# Altium project Krapong-ROV-B-TUBE.PrjPcb
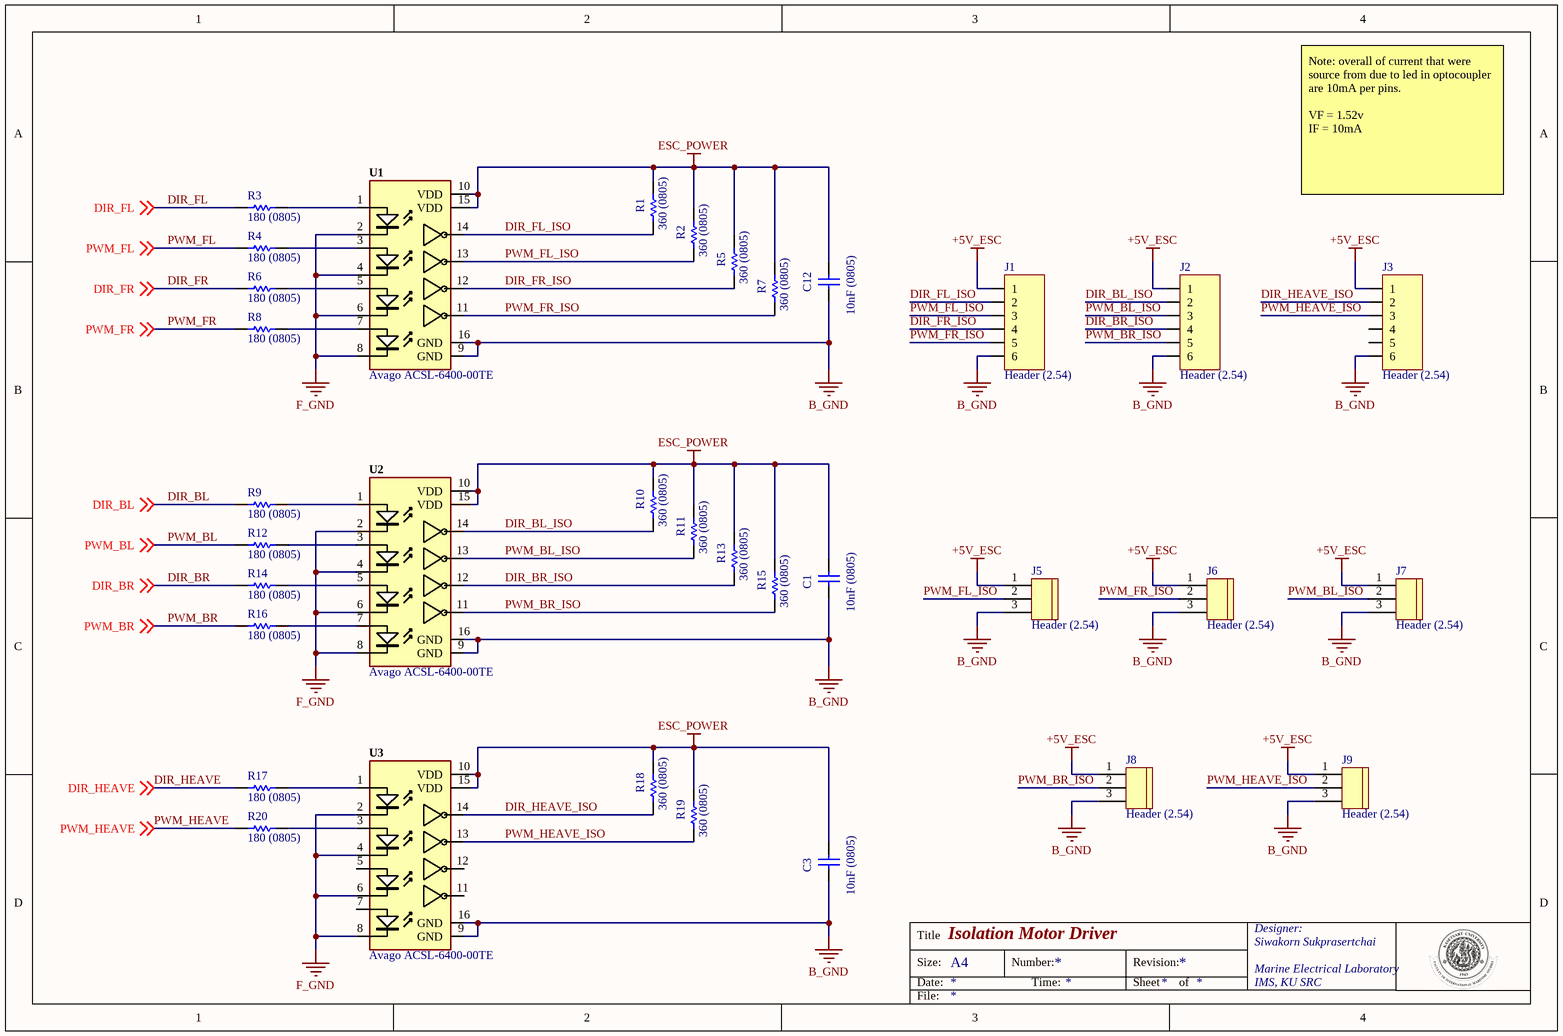
[diagram p0: PWM_Isolated.SchDoc]
3 sheets, 76 parts. Net scope: global (net labels, ports and power ports of the same name join across sheets).
Sheets:
  PWM_Isolated.SchDoc
  Power.SchDoc
  Nano_Shield.SchDoc

## Sheet PWM_Isolated.SchDoc: Isolation Motor Driver
size A4; PageSetup: Record=PageOptions|CenterHorizontal=True|CenterVertical=True|PrintScale=0.97|XCorrection=1.00|YCorrection=1.00|PrintKind=0|BorderSize=5000000|LeftOffset=0|BottomOffset=0|Orientation=2|PaperLength=1000|PaperWidth=1000|Scale=100|PaperSource=7|PrintQuality=-3|MediaType=1|DitherType=10|PrintScaleMode=1|PaperKind=A4|PaperIndex=9

### Parts
C1  10nF (0805)  [CAPC2013X94X50NL20T25]
C3  10nF (0805)  [CAPC2013X94X50NL20T25]
C12  10nF (0805)  [CAPC2013X94X50NL20T25]
J1  Header (2.54)  [PCB-cqg2o6bffgevoirlg0wu-1]
J2  Header (2.54)  [PCB-cqg2o6bffgevoirlg0wu-1]
J3  Header (2.54)  [PCB-cqg2o6bffgevoirlg0wu-1]
J5  Header (2.54)  [PCB-euxx5fdf5mehbg45u1ir-1]
J6  Header (2.54)  [PCB-euxx5fdf5mehbg45u1ir-1]
J7  Header (2.54)  [PCB-euxx5fdf5mehbg45u1ir-1]
J8  Header (2.54)  [PCB-euxx5fdf5mehbg45u1ir-1]
J9  Header (2.54)  [PCB-euxx5fdf5mehbg45u1ir-1]
R1  360 (0805)  [RESC2013X60X40NL15T20]
R2  360 (0805)  [RESC2013X60X40NL15T20]
R3  180 (0805)  [RESC2013X60X40NL15T20]
R4  180 (0805)  [RESC2013X60X40NL15T20]
R5  360 (0805)  [RESC2013X60X40NL15T20]
R6  180 (0805)  [RESC2013X60X40NL15T20]
R7  360 (0805)  [RESC2013X60X40NL15T20]
R8  180 (0805)  [RESC2013X60X40NL15T20]
R9  180 (0805)  [RESC2013X60X40NL15T20]
R10  360 (0805)  [RESC2013X60X40NL15T20]
R11  360 (0805)  [RESC2013X60X40NL15T20]
R12  180 (0805)  [RESC2013X60X40NL15T20]
R13  360 (0805)  [RESC2013X60X40NL15T20]
R14  180 (0805)  [RESC2013X60X40NL15T20]
R15  360 (0805)  [RESC2013X60X40NL15T20]
R16  180 (0805)  [RESC2013X60X40NL15T20]
R17  180 (0805)  [RESC2013X60X40NL15T20]
R18  360 (0805)  [RESC2013X60X40NL15T20]
R19  360 (0805)  [RESC2013X60X40NL15T20]
R20  180 (0805)  [RESC2013X60X40NL15T20]
U1  Avago ACSL-6400-00TE  [PCB-bbpchabnk3r0s5lan1zs-1]
U2  Avago ACSL-6400-00TE  [PCB-bbpchabnk3r0s5lan1zs-1]
U3  Avago ACSL-6400-00TE  [PCB-bbpchabnk3r0s5lan1zs-1]

### Nets
+5V_ESC: J1.1 J2.1 J3.1 J5.1 J6.1 J7.1 J8.1 J9.1
B_GND: C1.1 C3.1 C12.1 J1.6 J2.6 J3.6 J5.3 J6.3 J7.3 J8.3 J9.3 U1.9(GND) U1.16(GND) U2.9(GND) U2.16(GND) U3.9(GND) U3.16(GND)
ESC_POWER: C1.2 C3.2 C12.2 R1.1 R2.1 R5.1 R7.1 R10.1 R11.1 R13.1 R15.1 R18.1 R19.1 U1.10(VDD) U1.15(VDD) U2.10(VDD) U2.15(VDD) U3.10(VDD) U3.15(VDD)
F_GND: U1.2 U1.4 U1.6 U1.8 U2.2 U2.4 U2.6 U2.8 U3.2 U3.4 U3.6 U3.8
DIR_BL: R9.2 ; off-sheet DIR_BL
DIR_BL_ISO: J2.2 R10.2 U2.14
DIR_BR: R14.2 ; off-sheet DIR_BR
DIR_BR_ISO: J2.4 R13.2 U2.12
DIR_FL: R3.2 ; off-sheet DIR_FL
DIR_FL_ISO: J1.2 R1.2 U1.14
DIR_FR: R6.2 ; off-sheet DIR_FR
DIR_FR_ISO: J1.4 R5.2 U1.12
DIR_HEAVE: R17.2 ; off-sheet DIR_HEAVE
DIR_HEAVE_ISO: J3.2 R18.2 U3.14
PWM_BL: R12.2 ; off-sheet PWM_BL
PWM_BL_ISO: J2.3 J7.2 R11.2 U2.13
PWM_BR: R16.2 ; off-sheet PWM_BR
PWM_BR_ISO: J2.5 J8.2 R15.2 U2.11
PWM_FL: R4.2 ; off-sheet PWM_FL
PWM_FL_ISO: J1.3 J5.2 R2.2 U1.13
PWM_FR: R8.2 ; off-sheet PWM_FR
PWM_FR_ISO: J1.5 J6.2 R7.2 U1.11
PWM_HEAVE: R20.2 ; off-sheet PWM_HEAVE
PWM_HEAVE_ISO: J3.3 J9.2 R19.2 U3.13
NetR3_1: R3.1 U1.1
NetR4_1: R4.1 U1.3
NetR6_1: R6.1 U1.5
NetR8_1: R8.1 U1.7
NetR9_1: R9.1 U2.1
NetR12_1: R12.1 U2.3
NetR14_1: R14.1 U2.5
NetR16_1: R16.1 U2.7
NetR17_1: R17.1 U3.1
NetR20_1: R20.1 U3.3

Not connected (* = marked no-connect by the designer): J3 4 5; U3 5 7 11 12

### Notes on the sheet
- Note: overall of current that were source from due to led in optocoupler are 10mA per pins.
  VF = 1.52v
  IF = 10mA
- Title
- Size:
- Date:
- A4
- Number:
- Time:
- Revision:
- Sheet
- of
- Designer:
- Siwakorn Sukprasertchai
- Marine Electrical Laboratory
- IMS, KU SRC
- File:

### Library data of the parts
C1 C3 C12 = CMP-16466678-5: CAP CER 10NF 50V 5% X7R 0805; Manufacturer Part Number: 08055C103JAT2A; Case/Package (SI): 2012; Capacitance: 1e-08 F; Voltage Rating (DC): 50.0 V; Dielectric Material: Ceramic Multilayer; Lead-Free Status: Lead Free; Insulation Resistance: 1e+11 ?; Size-Width: 0.0012446 m; REACH SVHC Compliance: No SVHC; Capacitance Tolerance: ±5%; Case/Package: 0805; Mounting Style: Surface Mount; Size-Thickness: 0.0009398 m; Dielectric Characteristic: X7R; Octopart Url: https://octopart.com/08055c103jat2a-avx+interconnect+%2F+elco-39513106; Size-Height: 0.00094 m; Size-Length: 0.0020066 m; Number of Pins: 2; RoHS: Compliant; OctopartID: 02fac9aacb8edd3d
J1-J3 = CMP-c0620b0c5e311fa5-2: Wire-To-Board Connector, Right Angle, AMPMODU Mod II Series, Through Hole, Header, 6, 2.54 mm; Manufacturer Part Number: 826947-6; Number of Contacts: 6; Pin Pitch: 2.54 mm; Gender: Male; Current Rating: 3.00 A; ELV Compliant: Compliant; Octopart URL: http://octopart.com/826947-6-te+connectivity+%2F+amp-40155957; Orientation: Right Angle; Housing Color: Green; Contact Material: Phosphor Bronze; REACH SVHC Compliance: No SVHC; Mounting Style: PCB; Packaging: Box; Housing Material: Thermoplastic; Lifecycle Status: Active; Flammability Rating: UL 94 V-0; RoHS: Compliant; Contact Plating: Tin; OctopartID: c0620b0c5e311fa5
J5-J9 = CMP-b27b7b724c836dbc-1: Pin strip (standard) MTA-100 Total number of pins 3 TE Connectivity 640455-3 1 pc(s); Pin Pitch: 2.54 mm; Shrouded: No; Number of Positions: 3; Mounting Angle: 90.0 °; Voltage Rating (AC): 250 V; ELV Compliant: Compliant; Gender: Male; Lead-Free Status: Lead Free; Octopart URL: http://octopart.com/640455-3-te+connectivity+%2F+amp-252830; Manufacturer Part Number: 640455-3; Orientation: Right Angle; Color: Natural; RoHS: Compliant; Packaging: Bulk; Size-Length: 7.62 mm; Lifecycle Status: Active; Number of Contacts: 3; Housing Color: Natural; Contact Material: Copper Alloy; Contact Plating: Tin; Flammability Rating: UL 94 V-0; Mounting Style: Through Hole; Number of Rows: 1; Size-Height: 5.71 mm; Size-Width: 7.87 mm; Housing Material: Polyester; OctopartID: b27b7b724c836dbc
R1-R20 = CMP-1860549-2: RES SMD 10K OHM 1% 1/3W 0805; Lead-Free Status: Lead Free; Power Rating: 0.125 W; Resistance: 10000.0 ?; Voltage Rating (DC): 150.0 V; Case/Package: 0805; Mounting Style: Surface Mount; Number of Pins: 2; Octopart Url: https://octopart.com/crcw080510k0fkeahp-vishay-42634554; OctopartID: fa6931e9523525ae; Packaging: Cut Tape (CT); REACH SVHC Compliance: No SVHC; Resistance Tolerance: ±1%; RoHS: Compliant
U1-U3 = CMP-6f44a640fcefb083-4: Multi-Channel and Bi-Directional, 15 MBd (typ) Digital Logic Gate Optocoupler; Input Current: 0.015 A; Lead-Free Status: Lead Free; Output Voltage: 7.0 V; Number of Channels: 4; Rise Time: 3.5e-08 s; Data Rate: 15000000.0 bps; Isolation Voltage: 2500.0 V; Input Voltage (DC): 1.52 V; Lifecycle Status: Active; Octopart URL: http://octopart.com/acsl-6400-00te-avago-964301; Number of Pins: 16; Packaging: Tube; RoHS: Compliant; REACH SVHC Compliance: No SVHC; Manufacturer Part Number: ACSL-6400-00TE; Mounting Style: Surface Mount; OctopartID: 6f44a640fcefb083; Case/Package: SOIC

## Sheet Power.SchDoc: Power & Interfacing
size A4; PageSetup: Record=PageOptions|CenterHorizontal=True|CenterVertical=True|PrintScale=0.97|XCorrection=1.00|YCorrection=1.00|PrintKind=0|BorderSize=5000000|LeftOffset=0|BottomOffset=0|Orientation=2|PaperLength=1000|PaperWidth=1000|Scale=100|PaperSource=7|PrintQuality=-3|MediaType=1|DitherType=10|PrintScaleMode=1|PaperKind=A4|PaperIndex=9
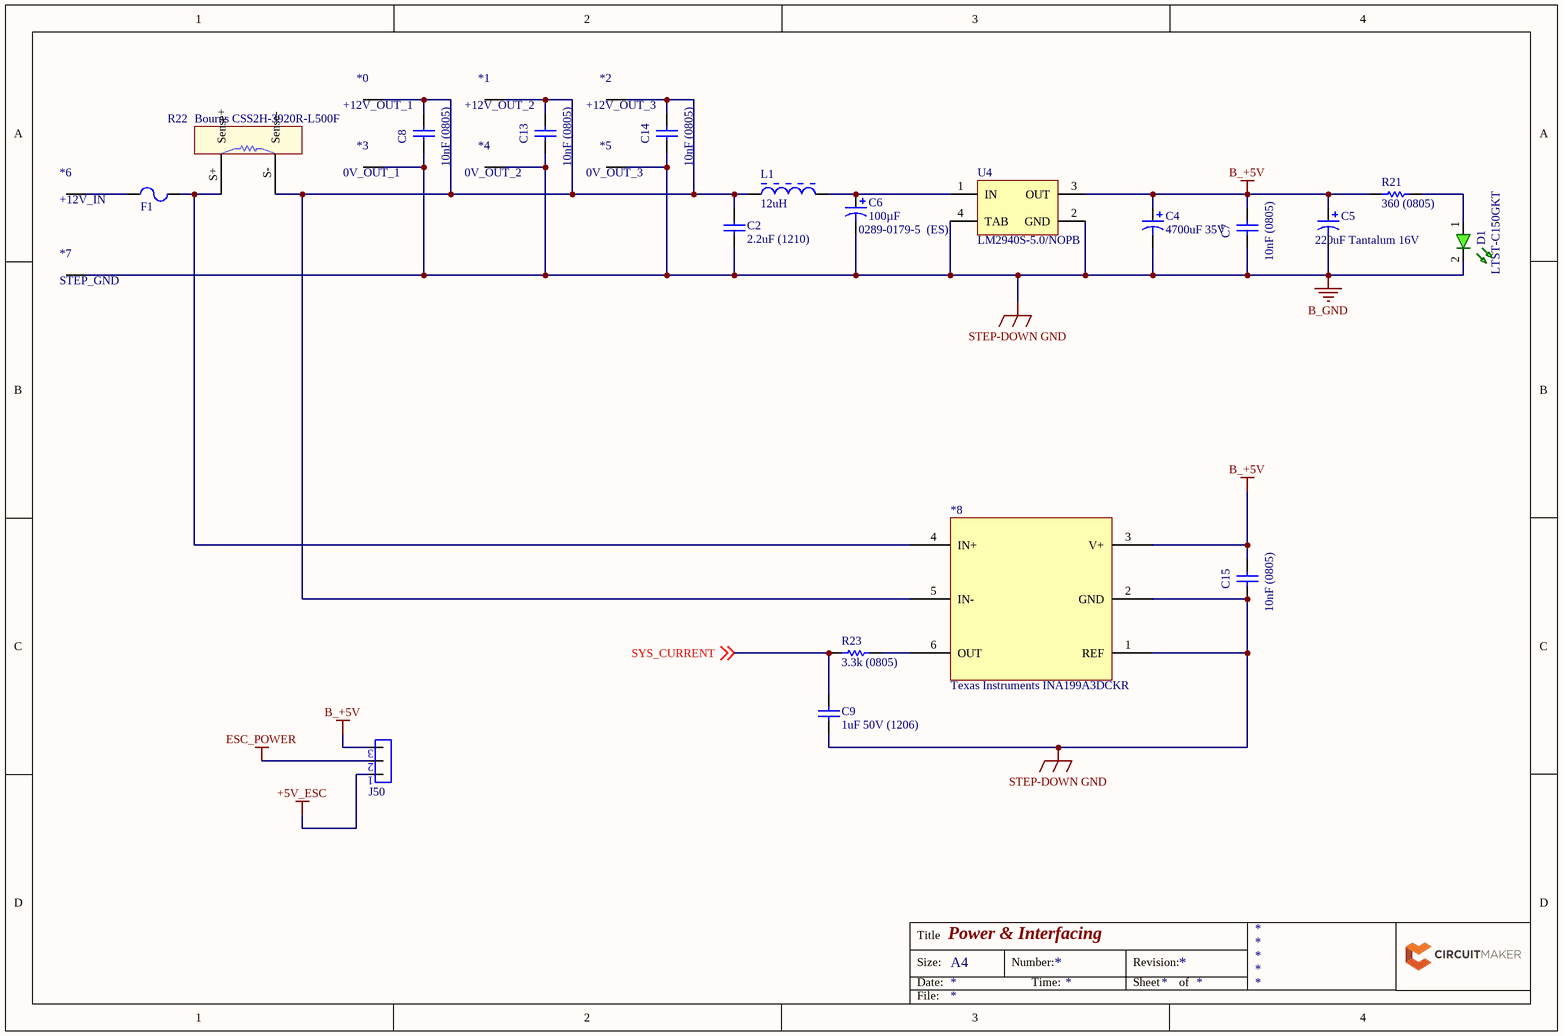
[diagram p1: Power.SchDoc]

### Parts
*0  +12V_OUT_1  [PCB-pcj1l6roq5gpi9u538ps-1]
*1  +12V_OUT_2  [PCB-pcj1l6roq5gpi9u538ps-1]
*2  +12V_OUT_3  [PCB-pcj1l6roq5gpi9u538ps-1]
*3  0V_OUT_1  [PCB-pcj1l6roq5gpi9u538ps-1]
*4  0V_OUT_2  [PCB-pcj1l6roq5gpi9u538ps-1]
*5  0V_OUT_3  [PCB-pcj1l6roq5gpi9u538ps-1]
*6  +12V_IN  [PCB-pcj1l6roq5gpi9u538ps-1]
*7  STEP_GND  [PCB-pcj1l6roq5gpi9u538ps-1]
*8  Texas Instruments INA199A3DCKR  [PCB-77zgin3zajz1p7ole171-1]
C2  2.2uF (1210)  [PCB-2fbb0vau3p468w0y920g-1]
C4  4700uF 35V  [PCB-uagykt4yf5hbq2so0sas-1]
C5  220uF Tantalum 16V  [PCB-fa1e6qpy6fbu77u2ye0h-1]
C6  100µF  OctopartID: 0289-0179-5  (ES)  [PCB-ec5i0bi6g8n3i6bd77c9-1]
C7  10nF (0805)  [CAPC2013X94X50NL20T25]
C8  10nF (0805)  [CAPC2013X94X50NL20T25]
C9  1uF 50V (1206)  [CAPC3216X180X55NL20T25]
C13  10nF (0805)  [CAPC2013X94X50NL20T25]
C14  10nF (0805)  [CAPC2013X94X50NL20T25]
C15  10nF (0805)  [CAPC2013X94X50NL20T25]
D1  Manufacturer Part Number: LTST-C150GKT  [PCB-ol758qabjjwuqvqjb2k1-1]  (hidden comment: Lite-On LTST-C150GKT)
F1  Keystone 3544-2  [PCB-p3yqezitk9kmwwp2mp00-1]  (value not drawn)
J50  TE Connectivity / AMP 5-146274-3  [PCB-m19gj7kkh000buv4lmik-1]  (value not drawn)
L1  12uH  [BOUR-SDR0403-2_V]
R21  360 (0805)  [RESC2013X60X40NL15T20]
R22  Bourns CSS2H-3920R-L500F  [PCB-p7sd064g1v6dorbgawsb-1]
R23  3.3k (0805)  [RESC2013X60X40NL15T20]
U4  LM2940S-5.0/NOPB  [TS3B_L]

### Nets
+5V_ESC: J50.1
B_+5V: *8.3(V+) C4.1 C5.1 C7.2 C15.2 J50.3 R21.1 U4.3(OUT)
B_GND: *3.0 *4.0 *5.0 *7.0 *8.1(REF) *8.2(GND) C2.1 C4.2 C5.2 C6.2 C7.1 C8.1 C9.1 C13.1 C14.1 C15.1 D1.2(K) U4.2(GND) U4.4(TAB)  [also labelled STEP-DOWN GND]
ESC_POWER: J50.2
SYS_CURRENT: C9.2 R23.2 ; off-sheet SYS_CURRENT
Net*0_0: *0.0 *1.0 *2.0 *8.5(IN-) C2.2 C8.2 C13.2 C14.2 L1.1 R22.S-(Sense-)
Net*6_0: *6.0 F1.1
Net*8_4: *8.4(IN+) F1.2 R22.S+(Sense+)
Net*8_6: *8.6(OUT) R23.1
NetC6_1: C6.1 L1.2 U4.1(IN)
NetD1_1: D1.1(A) R21.2

### Notes on the sheet
- Title
- Size:
- Date:
- A4
- Number:
- Time:
- Revision:
- Sheet
- of
- File:

### Library data of the parts
*0-*7 = CMP-5ddc94dc62be821b-2: Standoff; 12 mm; M3 x 0.5; Brass; Hex; Nickel Plate; 8 in.; 8 in.; Manufacturer Part Number: 24314; Lead-Free Status: Lead Free; Size-Width: 5.00 mm; Octopart URL: http://octopart.com/24314-keystone-662020; OctopartID: 5ddc94dc62be821b; Size-Length: 12.0 mm; Material: Brass; RoHS: Compliant
*8 = CMP-6ab6a2a7a250b571-1: 26-V, Bi-Directional, Zero-Drift, Low- or High-Side, Voltage Output Current Shunt Monitor 6-SC70 -40 to 125; Lead-Free Status: Lead Free; Octopart URL: http://octopart.com/ina199a3dckr-texas+instruments-18607488; Manufacturer Part Number: INA199A3DCKR; Lifecycle Status: Active; RoHS: Compliant; OctopartID: 6ab6a2a7a250b571
C2 = Murata GRM32ER71H475KA88L-1: 1210 4.7 uF 50 V ±10% Tolerance X7R SMT Multilayer Ceramic Capacitor; Voltage Rating (DC): 50.0 V; Lead-Free Status: Lead Free; Capacitance: 4.7e-06 F; Case/Package (SI): 3225; Octopart URL: http://octopart.com/grm32er71h475ka88l-murata-196576; Manufacturer Part Number: GRM32ER71H475KA88L; Size-Height: 0.0025 m; Dielectric Characteristic: X7R; Size-Width: 0.0025 m; RoHS: Compliant; REACH SVHC Compliance: No SVHC; Mounting Style: Surface Mount; Capacitance Tolerance: ±10%; Packaging: Cut Tape (CT), Tape & Reel (TR); Size-Length: 0.0032 m; Size-Thickness: 0.0025 m; Lifecycle Status: Active; Case/Package: 1210; Number of Pins: 2; OctopartID: 8d884480570e524f
C4 = CMP-4cda85d37137931d-1: 18mm x 40mm l/s=7.5mm 105deg 4700uf 35v Radial Leads Lesr Aluminum Electrolytic Cap; Manufacturer Part Number: UPW1V472MHD; Voltage Rating (DC): 35.0 V; Lead-Free Status: Lead Free; Capacitance: 0.0047 F; Equivalent Series Resistance (ESR): 0.028 ?; Capacitance Tolerance: ±20%; Octopart URL: http://octopart.com/upw1v472mhd-nichicon-202891; Size-Length: 0.04 m; Size-Height: 0.04 m; RoHS: Compliant; Mounting Style: Through Hole; Dielectric Material: Aluminum Electrolytic; Packaging: Bulk; Size-Diameter: 0.018 m; OctopartID: 4cda85d37137931d
C5 = CMP-d5771c7fde4f0ab0-1: Kemet T491E227K016AT Cap Tant Solid 220uF 16V E CASE 10% (7.3 X 6 X 3.6mm) SMD 7260-38 0.9 Ohm 125C Automotive T/R; Voltage Rating (DC): 16.0 V; Lead-Free Status: Lead Free; Equivalent Series Resistance (ESR): 900 m?; Capacitance: 220 µF; Octopart URL: http://octopart.com/t491e227k016at-kemet-142942; Manufacturer Part Number: T491E227K016AT; Case/Package: 7260-38; Size-Width: 6.00 mm; RoHS: Compliant; Mounting Style: Surface Mount; Dielectric Material: Tantalum; Packaging: Cut Tape (CT), Tape & Reel (TR); Size-Length: 7.30 mm; Size-Height: 3.60 mm; Capacitance Tolerance: ±10%; Number of Pins: 2; OctopartID: d5771c7fde4f0ab0
C6 = CMP-42da8bd37ecc9d1d-1: WX Series 100 uF 25 V ±20 % Surface Mount Chip Aluminum Electrolytic Capacitor; Capacitance Tolerance: ±20%; Voltage Rating (DC): 25.0 V; Size-Height: 5.40 mm; Dielectric Material: Aluminum Electrolytic; Size-Diameter: 8.00 mm
C7 C8 C13-C15 = CMP-16466678-5: as C1 on sheet PWM_Isolated; Size-Width: 0.0012446 m; REACH SVHC Compliance: No SVHC; Capacitance Tolerance: ±5%; Case/Package: 0805; Mounting Style: Surface Mount; Size-Thickness: 0.0009398 m; Dielectric Characteristic: X7R; Octopart Url: https://octopart.com/08055c103jat2a-avx+interconnect+%2F+elco-39513106; Size-Height: 0.00094 m; Size-Length: 0.0020066 m; Number of Pins: 2; RoHS: Compliant; OctopartID: 02fac9aacb8edd3d
C9 = CMP-121173-2: CAP CER 1UF 50V 10% X7R 1206; Capacitance: 1e-06 F; Case/Package (SI): 3216; Lead-Free Status: Lead Free; Voltage Rating (DC): 50.0 V; Capacitance Tolerance: ±10%; Dielectric Characteristic: X7R; Lifecycle Status: Active; Mounting Style: Surface Mount; Octopart Url: https://octopart.com/grm31cr71h105ka61l-murata-197460; OctopartID: 26d9efd000ebf91e; REACH SVHC Compliance: No SVHC; RoHS: Compliant; Size-Length: 0.0032 m; Size-Thickness: 0.0016 m; Size-Width: 0.0016 m
D1 = CMP-d7361e3491ff08f1-2: Green 3.2 x 1.6 x 1.1 mm 130° Water Clear 6 mcd 2.1 V Chip LED Surface Mount; Lead-Free Status: Lead Free; Case/Package (SI): 3216; Luminous Intensity: 6.00 mcd; Forward Voltage: 2.10 V; Lens Type: Non-Diffused; Wavelength: 565 nm; Manufacturer: LITE-ON; Color: Green; RoHS: Compliant; Size-Length: 3.20 mm; Case/Package: 1206; OctopartID: d7361e3491ff08f1; Octopart URL: http://octopart.com/ltst-c150gkt-lite-on-549807; Size-Height: 1.10 mm; Packaging: Tape & Reel (TR); Viewing Angle: 130 °; Mounting Style: Surface Mount, Vertical; Size-Width: 1.60 mm
F1 = CMP-54019d0b3e378bc6-3: Fuse Clip; 500 VAC; 30 A; PCB; For 0.110 in. x 0.032 in. mini blade fuses; Voltage Rating (DC): 500 V; Color: Black; Lead-Free Status: Lead Free; Current Rating: 30.0 A; Number of Circuits: 1; Octopart URL: http://octopart.com/3544-2-keystone-20304; Contact Plating: Brass; Voltage Rating (AC): 500 V; Size-Height: 8.70 mm; Size-Width: 4.76 mm; Packaging: Bulk; RoHS: Compliant; Mounting Style: PCB, Snap-In; Flammability Rating: UL 94 V-0; OctopartID: 54019d0b3e378bc6; REACH SVHC Compliance: No SVHC; Contact Material: Brass; Manufacturer Part Number: 3544-2; Lifecycle Status: Not Listed by Manufacturer; Size-Length: 14.7 mm
J50 = CMP-740dbf71fd8babca-9: AMPMODU 3 Position 2.54 mm Single Row Through-Hole Straight Breakaway Header; ELV Compliant: Compliant; Number of Contacts: 3; Gender: Male; Lead-Free Status: Lead Free; Manufacturer Part Number: 5-146274-3; Octopart URL: http://octopart.com/5-146274-3-te+connectivity+%2F+amp-41331936; Mounting Style: PCB; Contact Material: Phosphor Bronze; Lifecycle Status: Active; Housing Color: Black; OctopartID: 740dbf71fd8babca; RoHS: Compliant; Orientation: Vertical; Flammability Rating: UL 94 V-0; Contact Plating: Tin, Tin over Nickel
L1 = CMP-911394-2: SDR0403 Series Power Inductor, 12 uF +/- 20 %, 0.21 Ohm, -40 to 125 degC, 2-Pin SMD, RoHS, Tape and Reel; Inductance: 1.2e-05 H; Q-Factor: 28.0; Octopart Url: https://octopart.com/sdr0403-120ml-bourns-1990149; OctopartID: 7b20b2340043a4e7; Packaging: Cut Tape (CT); REACH SVHC Compliance: No SVHC; RoHS: Compliant
R21 R23 = CMP-1860549-2: as R1 on sheet PWM_Isolated; Case/Package: 0805; Mounting Style: Surface Mount; Number of Pins: 2; Octopart Url: https://octopart.com/crcw080510k0fkeahp-vishay-42634554; OctopartID: fa6931e9523525ae; Packaging: Cut Tape (CT); REACH SVHC Compliance: No SVHC; Resistance Tolerance: ±1%; RoHS: Compliant
R22 = CMP-5a03976e567885c4-2: Res Metal Strip 3920 0.0005 Ohm 1% 9W ±50ppm/C Pad SMD Automotive T/R; Resistance: 500 µ?; Power Rating: 9.00 W; Manufacturer Part Number: CSS2H-3920R-L500F; OctopartID: 5a03976e567885c4; Packaging: Cut Tape (CT); Octopart URL: http://octopart.com/css2h-3920r-l500f-bourns-73869597; Resistance Tolerance: ±1%; RoHS: Compliant
U4 = CMP-0062-00588-3: 1A Low Dropout Regulator, 3-pin TO-263, Pb-Free; Current Rating: 1.0 A; Dropout Voltage: 0.5 V; Lead-Free Status: Contains Lead; Number of Outputs: 1; Output Capacitor Type: Tantalum; Output Voltage: 5.0 V; Quiescent Current: 0.01 A; Lifecycle Status: Active; Mounting Style: Surface Mount; Number of Pins: 3; Number of Regulated Outputs: 1; Octopart Url: https://octopart.com/lm2940s-5.0%2Fnopb-texas+instruments-24813565; OctopartID: 84f94c893e625b3e; Output Current: 1.0 A; Packaging: Tube; REACH SVHC Compliance: No SVHC; RoHS: Non-Compliant

## Sheet Nano_Shield.SchDoc
size A4
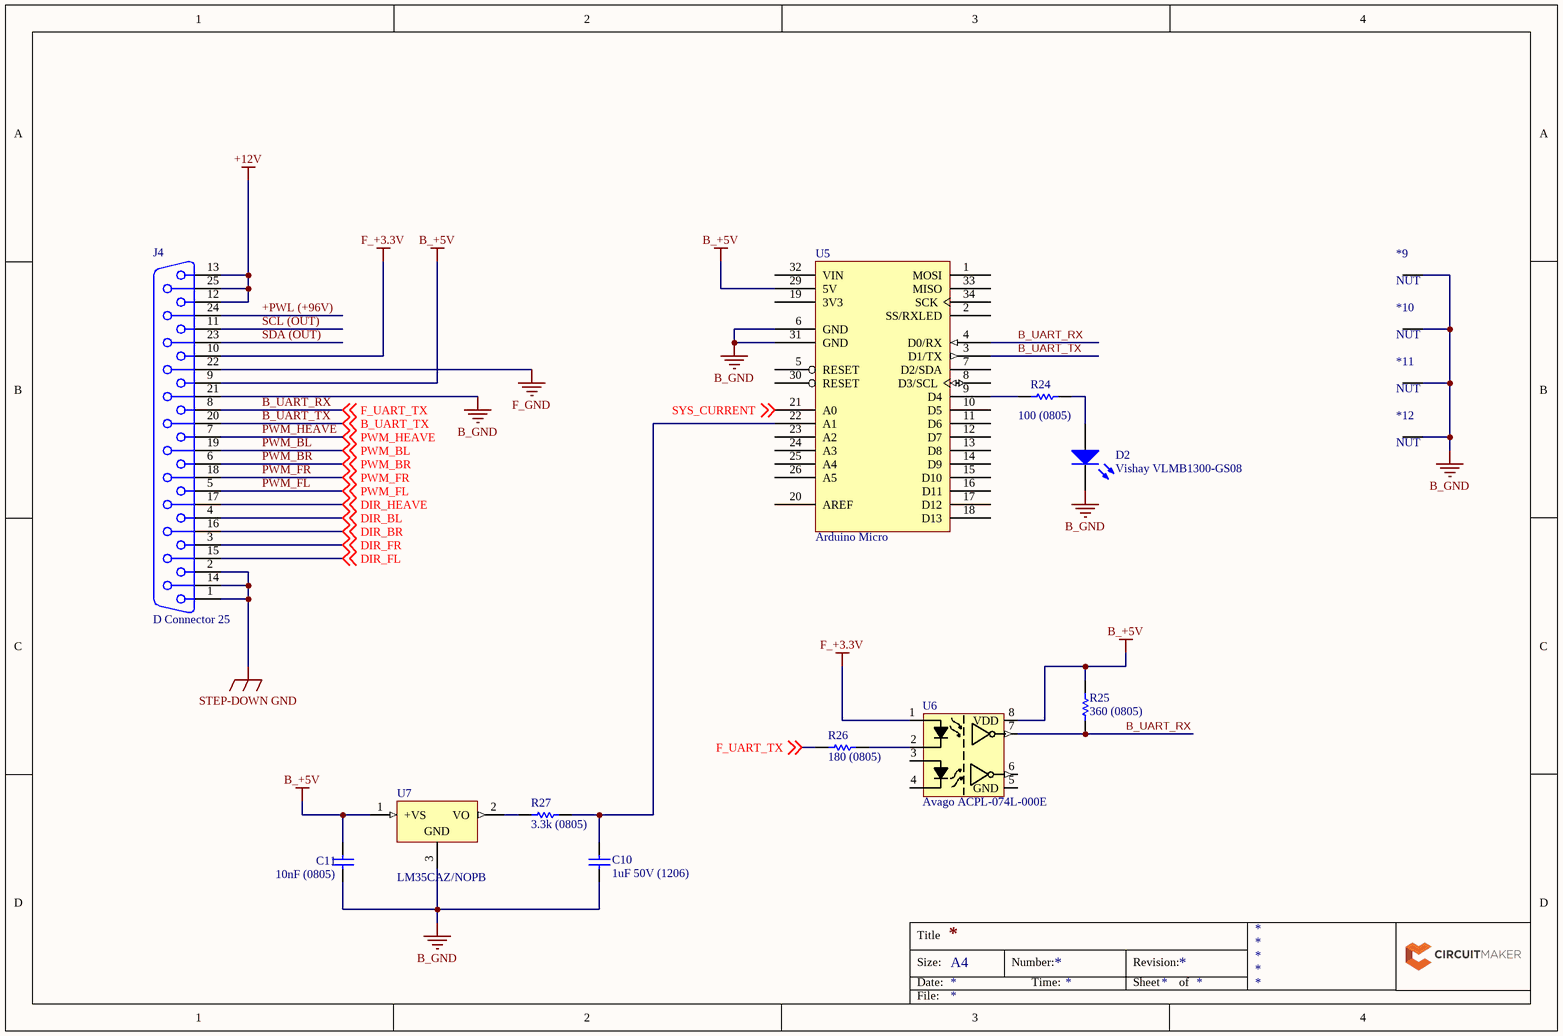
[diagram p2: Nano_Shield.SchDoc]

### Parts
*9  NUT  [PCB-pcj1l6roq5gpi9u538ps-1]
*10  NUT  [PCB-pcj1l6roq5gpi9u538ps-1]
*11  NUT  [PCB-pcj1l6roq5gpi9u538ps-1]
*12  NUT  [PCB-pcj1l6roq5gpi9u538ps-1]
C10  1uF 50V (1206)  [CAPC3216X180X55NL20T25]
C11  10nF (0805)  [CAPC2013X94X50NL20T25]
D2  Vishay VLMB1300-GS08  [0603D_C]
J4  D Connector 25  [PCB-w6wyndea0hgjvu195v0z-1]
R24  100 (0805)  [RESC2013X60X40NL15T20]
R25  360 (0805)  [RESC2013X60X40NL15T20]
R26  180 (0805)  [RESC2013X60X40NL15T20]
R27  3.3k (0805)  [RESC2013X60X40NL15T20]
U5  Arduino Micro  [Soldered]
U6  Avago ACPL-074L-000E  [PCB-tvxoajnlj650fdg499ex-1]
U7  LM35CAZ/NOPB  [Z03A]

### Nets
+12V: J4.12 J4.13 J4.25
B_+5V: C11.2 J4.9 R25.1 U5.29(5V) U6.8(VDD) U7.1(+VS)
B_GND: *9.0 *10.0 *11.0 *12.0 C10.1 C11.1 D2.C J4.1 J4.2 J4.14 J4.21 U5.6(GND) U5.31(GND) U7.3(GND)  [also labelled STEP-DOWN GND]
F_+3.3V: J4.10 U6.1
F_GND: J4.22
+PWL (+96V): J4.24
B_UART_RX: J4.8 R25.2 R26.2 U5.4(D0/RX) U6.7 ; off-sheet F_UART_TX  [also labelled F_UART_TX]
B_UART_TX: J4.20 U5.3(D1/TX) ; off-sheet B_UART_TX
DIR_BL: J4.4 ; off-sheet DIR_BL
DIR_BR: J4.16 ; off-sheet DIR_BR
DIR_FL: J4.15 ; off-sheet DIR_FL
DIR_FR: J4.3 ; off-sheet DIR_FR
DIR_HEAVE: J4.17 ; off-sheet DIR_HEAVE
PWM_BL: J4.19 ; off-sheet PWM_BL
PWM_BR: J4.6 ; off-sheet PWM_BR
PWM_FL: J4.5 ; off-sheet PWM_FL
PWM_FR: J4.18 ; off-sheet PWM_FR
PWM_HEAVE: J4.7 ; off-sheet PWM_HEAVE
SCL (OUT): J4.11
SDA (OUT): J4.23
SYS_CURRENT: U5.21(A0) ; off-sheet SYS_CURRENT
NetC10_2: C10.2 R27.1 U5.22(A1)
NetD2_A: D2.A R24.2
NetR24_1: R24.1 U5.9(D4)
NetR26_1: R26.1 U6.2
NetR27_2: R27.2 U7.2(VO)

Not connected (* = marked no-connect by the designer): U5 1(MOSI) 2(SS/RXLED) 5(RESET) 7(D2/SDA) 8(D3/SCL) 10(D5) 11(D6) 12(D7) 13(D8) 14(D9) 15(D10) 16(D11) 17(D12) 18(D13) 19(3V3) 20(AREF) 23(A2) 24(A3) 25(A4) 26(A5) 30(RESET) 32(VIN) 33(MISO) 34(SCK); U6 3 4 5(GND) 6

### Notes on the sheet
- Title
- Size:
- Date:
- A4
- Number:
- Time:
- Revision:
- Sheet
- of
- File:

### Library data of the parts
*9-*12 = CMP-5ddc94dc62be821b-2: as *0 on sheet Power; Size-Width: 5.00 mm; Octopart URL: http://octopart.com/24314-keystone-662020; OctopartID: 5ddc94dc62be821b; Size-Length: 12.0 mm; Material: Brass; RoHS: Compliant
C10 = CMP-121173-2: as C9 on sheet Power; Capacitance Tolerance: ±10%; Dielectric Characteristic: X7R; Lifecycle Status: Active; Mounting Style: Surface Mount; Octopart Url: https://octopart.com/grm31cr71h105ka61l-murata-197460; OctopartID: 26d9efd000ebf91e; REACH SVHC Compliance: No SVHC; RoHS: Compliant; Size-Length: 0.0032 m; Size-Thickness: 0.0016 m; Size-Width: 0.0016 m
C11 = CMP-16466678-5: as C1 on sheet PWM_Isolated; Size-Width: 0.0012446 m; REACH SVHC Compliance: No SVHC; Capacitance Tolerance: ±5%; Case/Package: 0805; Mounting Style: Surface Mount; Size-Thickness: 0.0009398 m; Dielectric Characteristic: X7R; Octopart Url: https://octopart.com/08055c103jat2a-avx+interconnect+%2F+elco-39513106; Size-Height: 0.00094 m; Size-Length: 0.0020066 m; Number of Pins: 2; RoHS: Compliant; OctopartID: 02fac9aacb8edd3d
D2 = CMP-1563dd39390dcaa4-2: Blue 0603 130° 180 mcd Clear 3 V Surface Mount LED; Forward Voltage: 3.8 V; Luminous Intensity: 0.18 cd; Lead-Free Status: Lead Free; REACH SVHC Compliance: No SVHC; RoHS: Compliant; Manufacturer Part Number: VLMB1300-GS08; OctopartID: 1563dd39390dcaa4; Packaging: Cut Tape (CT); Viewing Angle: 130 °; Octopart URL: http://octopart.com/vlmb1300-gs08-vishay-22022408
J4 = CMP-d8a713f745850760-3: D Sub Connector, Amplimite HD-20, Amplimite HD-20 Series, DB, Plug, 25, Metal, Solder; Manufacturer Part Number: 5747842-4; ELV Compliant: Compliant; Gender: Male; Lead-Free Status: Lead Free; Pin Pitch: 2.77 mm; Number of Contacts: 25; Orientation: Right Angle; Packaging: Tray; Housing Color: Black; Mounting Style: Through Hole; RoHS: Compliant; Lifecycle Status: Active; Size-Length: 53.0 mm; Color: Black; Contact Plating: Gold over Nickel; OctopartID: d8a713f745850760; Contact Material: Brass; Number of Rows: 2; Size-Height: 12.6 mm; Housing Material: Nylon; Octopart URL: http://octopart.com/5747842-4-te+connectivity+%2F+amp-39499844; REACH SVHC Compliance: No SVHC; Material: Steel; Flammability Rating: UL 94 V-0; Number of Positions: 25; Size-Width: 18.7 mm
R24-R27 = CMP-1860549-2: as R1 on sheet PWM_Isolated; Case/Package: 0805; Mounting Style: Surface Mount; Number of Pins: 2; Octopart Url: https://octopart.com/crcw080510k0fkeahp-vishay-42634554; OctopartID: fa6931e9523525ae; Packaging: Cut Tape (CT); REACH SVHC Compliance: No SVHC; Resistance Tolerance: ±1%; RoHS: Compliant
U5 = CMP-b9da714574fd661d-9: Arduino Micro based on ATMega32u4; Manufacturer Part Number: A000053; Core Architecture: AVR; Arduino: Pro Micro (Mega32U4); Number of Bits: 8; Octopart URL: http://octopart.com/a000053-arduino-26601537; Microcontroller: ATMega32U; RoHS: Compliant; OctopartID: b9da714574fd661d; REACH SVHC Compliance: No SVHC
U6 = CMP-ee2b274cae1231ec-3: Optocoupler Logic-Out Push-Pull DC-IN 2-CH 8-Pin SOIC Tube; Lead-Free Status: Lead Free; Output Voltage: 6.50 V; Input Current: 18.0 mA; Isolation Voltage: 3.75 kV; Number of Pins: 8; Packaging: Tube; Octopart URL: http://octopart.com/acpl-074l-000e-avago-7169375; Manufacturer Part Number: ACPL-074L-000E; REACH SVHC Compliance: No SVHC; Lifecycle Status: Active; RoHS: Compliant; Mounting Style: Surface Mount; OctopartID: ee2b274cae1231ec
U7 = CMP-0066-00028-3: Precision Centigrade Temperature Sensor, 3-pin TO-92, Pb-Free; Lead-Free Status: Lead Free; Output Current: 0.01 A; Output Voltage: 6.0 V; Quiescent Current: 5.6e-05 A; Supply Current: 9.15e-05 A; Supply Voltage (DC): 4.0 V; Case/Package: TO-92; Lifecycle Status: Active; Mounting Style: Through Hole; Number of Pins: 3; Octopart Url: https://octopart.com/lm35caz%2Fnopb-texas+instruments-24814021; OctopartID: c3730b0347d01cb4; Packaging: Box; REACH SVHC Compliance: No SVHC; RoHS: Compliant

## Nets that join several sheets
+5V_ESC: PWM_Isolated (8 pins), Power (J50.1)
B_+5V: Power (8 pins), Nano_Shield (6 pins)
B_GND: PWM_Isolated (17 pins), Power (19 pins), Nano_Shield (14 pins)
ESC_POWER: PWM_Isolated (19 pins), Power (J50.2)
F_GND: PWM_Isolated (12 pins), Nano_Shield (J4.22)
DIR_BL: PWM_Isolated (R9.2), Nano_Shield (J4.4)
DIR_BR: PWM_Isolated (R14.2), Nano_Shield (J4.16)
DIR_FL: PWM_Isolated (R3.2), Nano_Shield (J4.15)
DIR_FR: PWM_Isolated (R6.2), Nano_Shield (J4.3)
DIR_HEAVE: PWM_Isolated (R17.2), Nano_Shield (J4.17)
PWM_BL: PWM_Isolated (R12.2), Nano_Shield (J4.19)
PWM_BR: PWM_Isolated (R16.2), Nano_Shield (J4.6)
PWM_FL: PWM_Isolated (R4.2), Nano_Shield (J4.5)
PWM_FR: PWM_Isolated (R8.2), Nano_Shield (J4.18)
PWM_HEAVE: PWM_Isolated (R20.2), Nano_Shield (J4.7)
SYS_CURRENT: Power (C9.2 R23.2), Nano_Shield (U5.21)